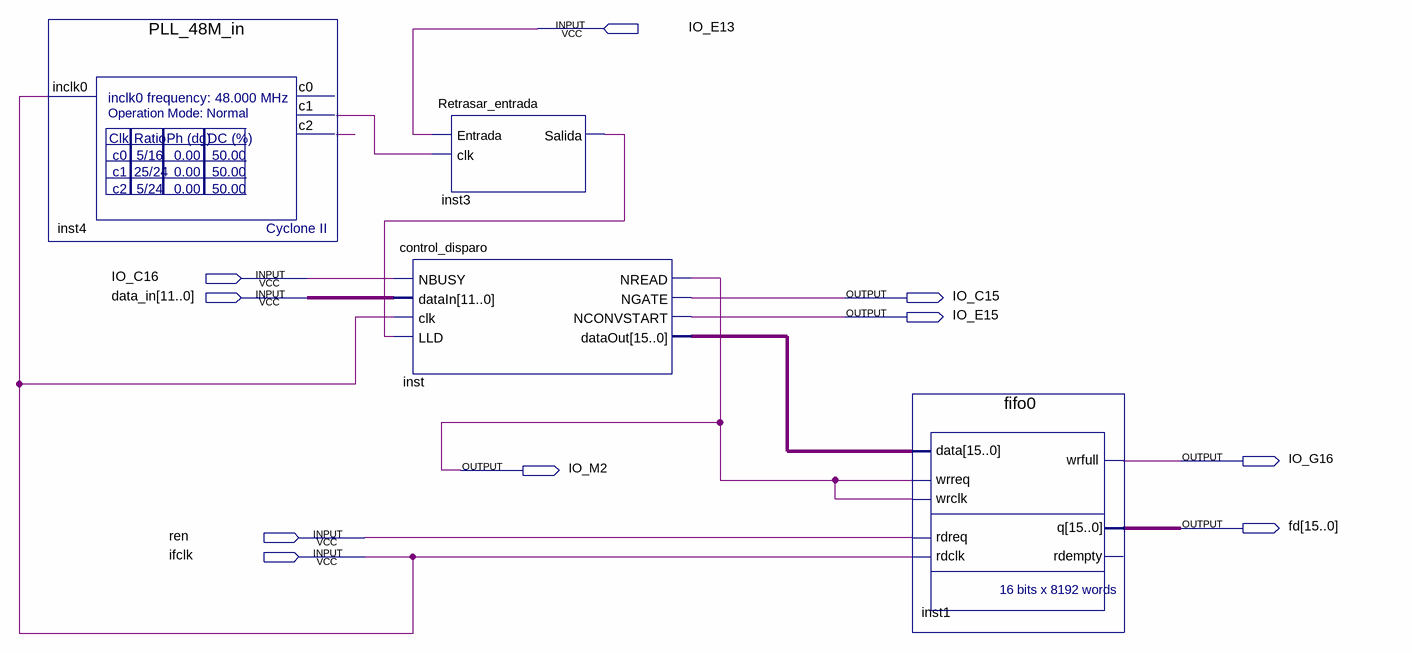
[diagram p0: schematic sheet]
// Quartus schematic Template.bdf as structural Verilog: 4 symbols, 10 pins
module Template (
  input  IO_E13,
  input  IO_C16,
  input  [11:0] data_in,
  input  ren,
  input  ifclk,
  output IO_C15,
  output IO_E15,
  output IO_G16,
  output IO_M2,
  output [15:0] fd
);

  wire inst3_salida, inst4_c1, inst4_c2;
  wire [15:0] inst_dataout;

  PLL_48M_in inst4 (.inclk0(ifclk), .c1(inst4_c1), .c2(inst4_c2));  // open: c0
  control_disparo inst (
    .NBUSY(IO_C16), .dataIn(data_in), .clk(ifclk), .LLD(inst3_salida), .NREAD(IO_M2), .NGATE(IO_C15),
    .NCONVSTART(IO_E15), .dataOut(inst_dataout));
  Retrasar_entrada inst3 (.Entrada(IO_E13), .clk(inst4_c1), .Salida(inst3_salida));
  fifo0 inst1 (
    .data(inst_dataout), .wrreq(IO_M2), .wrclk(IO_M2), .rdreq(ren), .rdclk(ifclk), .wrfull(IO_G16), .q(fd));  // open: rdempty
endmodule
